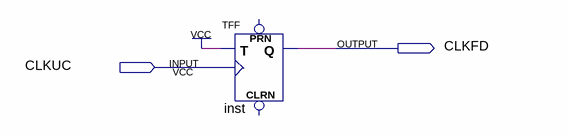
[diagram p0: schematic sheet]
// Quartus schematic teste.bdf as structural Verilog: 1 symbols, 2 pins
module teste (
  input  CLKUC,
  output CLKFD
);

  TFF inst (.T(1'b1), .CLK(CLKUC), .Q(CLKFD));  // open: PRN, CLRN
endmodule
